# EAGLE design goodfet30 (EAGLE 5.06)
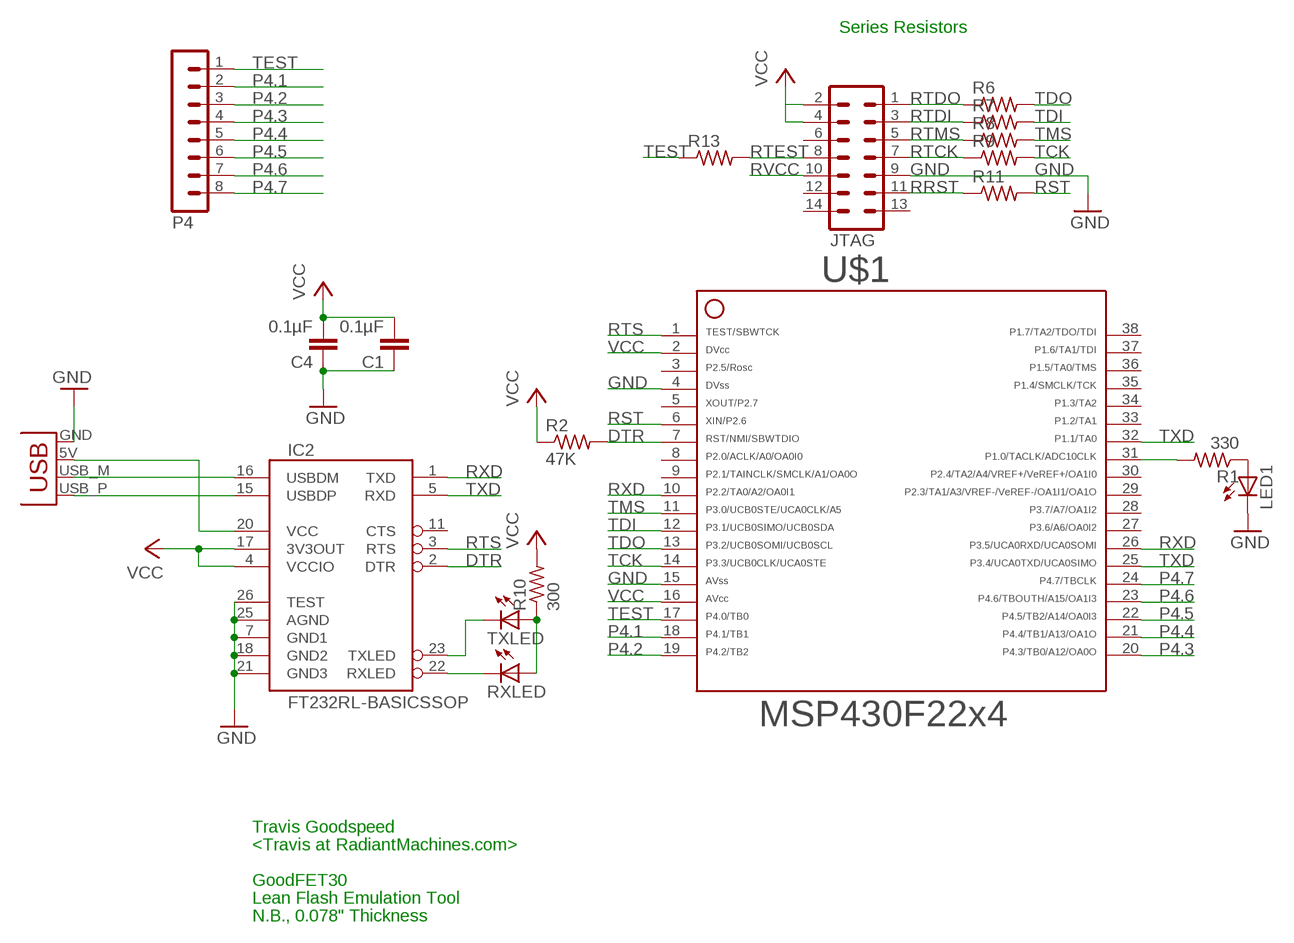
[diagram p0: schematic, sheet 1]

## Parts
C1  0.1µF  C-EUC0603  [C0603]
C4  0.1µF  C-EUC0603  [C0603]
IC2  FT232RL-BASICSSOP  [SSOP28DB]
JTAG  MA07-2  [MA07-2]
LED1  LEDCHIP-LED0603  [CHIP-LED0603]
P4  MA08-1  [MA08-1]
R1  330  R-US_R0603  [R0603]
R2  47K  R-US_R0603  [R0603]
R6  R-US_R0603  [R0603]
R7  R-US_R0603  [R0603]
R8  R-US_R0603  [R0603]
R9  R-US_R0603  [R0603]
R10  300  R-US_R0603  [R0603]
R11  R-US_R0603  [R0603]
R13  R-US_R0603  [R0603]
RXLED  LEDCHIP-LED0603  [CHIP-LED0603]
TXLED  LEDCHIP-LED0603  [CHIP-LED0603]
U$1  F22X4---DA38  [DA38]
X1  USBPCB  [USB-A-PCB]

## Nets
DTR: IC2.2(DTR) R2.2 U$1.7
GND: C1.1 C4.1 IC2.7(GND1) IC2.18(GND2) IC2.21(GND3) IC2.25(AGND) IC2.26(TEST) JTAG.9 LED1.C U$1.4 U$1.15 X1.GND
N$3: IC2.15(USBDP) X1.USB_P(D+)
N$4: IC2.16(USBDM) X1.USB_M(D-)
N$5: IC2.20(VCC) X1.5V(VBUS)
N$6: IC2.22(RXLED) RXLED.C
N$7: IC2.23(TXLED) TXLED.C
N$8: R10.1 RXLED.A TXLED.A
N$9: R1.2 U$1.31
N$10: LED1.A R1.1
P4.1: P4.2 U$1.18
P4.2: P4.3 U$1.19
P4.3: P4.4 U$1.20
P4.4: P4.5 U$1.21
P4.5: P4.6 U$1.22
P4.6: P4.7 U$1.23
P4.7: P4.8 U$1.24
RRST: JTAG.11 R11.1
RST: R11.2 U$1.6
RTCK: JTAG.7 R9.1
RTDI: JTAG.3 R7.1
RTDO: JTAG.1 R6.1
RTEST: JTAG.8 R13.2
RTMS: JTAG.5 R8.1
RTS: IC2.3(RTS) U$1.1
RVCC: JTAG.10
RXD: IC2.1(TXD) U$1.10 U$1.26
TCK: R9.2 U$1.14
TDI: R7.2 U$1.12
TDO: R6.2 U$1.13
TEST: P4.1 R13.1 U$1.17
TMS: R8.2 U$1.11
TXD: IC2.5(RXD) U$1.25 U$1.32
VCC: C1.2 C4.2 IC2.4(VCCIO) IC2.17(3V3OUT) JTAG.2 JTAG.4 R2.1 R10.2 U$1.2 U$1.16
Unconnected: IC2.11(CTS) JTAG.6 JTAG.12 JTAG.13 JTAG.14 U$1.3 U$1.5 U$1.8 U$1.9 U$1.27 U$1.28 U$1.29 U$1.30 U$1.33 U$1.34 U$1.35 U$1.36 U$1.37 U$1.38

## Notes on the sheet
- Series Resistors
- Travis Goodspeed
- <Travis at RadiantMachines.com>
- GoodFET30
- Lean Flash Emulation Tool
- N.B., 0.078" Thickness

## Library data of the parts
C1 C4 = rcl:C-EU: CAPACITOR, European symbol
IC2 = SparkFun:FT232RL-BASIC: USB UART This is the simplified version of the FT232RL unit. Only what you need, nothing you don't. Spark Fun Electronics SKU : COM-00650
JTAG = con-lstb:MA07-2: PIN HEADER
LED1 RXLED TXLED = led:LED: LED OSRAM: - CHIPLED LG R971, LG N971, LY N971, LG Q971, LY Q971, LO R971, LY R971 LH N974, LH R974 LS Q976, LO Q976, LY Q976 LO Q996 - Hyper CHIPLED LW Q18S LB Q993, LB Q99A, LB R99A - SideLED LS A670, LO A670, LY A670, LG A670, LP A670 LB A673, LV A673, LT A673, LW A673 LH A674 LY A675 LS A676, LA A676, LO A676, LY A676, LW A676 LS A679, LY A679, LG A679 - Hyper Micro SIDELED® LS Y876, LA Y876, LO Y876, LY Y876 LT Y87S - SmartLED LW L88C, LW L88S LB L89C, LB L89S, LG L890 LS L89K, LO L89K, LY L89K LS L896, LA L896, LO L896, LY L896 - TOPLED LS T670, LO T670, LY T670, LG T670, LP T670 LSG T670, LSP T670, LSY T670, LOP T670, LYG T670 LG T671, LOG T671, LSG T671 LB T673, LV T673, LT T673, LW T673 LH T674 LS T676, LA T676, LO T676, LY T676, LB T676, LH T676, LSB T676, LW T676 LB T67C, LV T67C, LT T67C, LS T67K, LO T67K, LY T67K, LW E67C LS E67B, LA E67B, LO E67B, LY E67B, LB E67C, LV E67C, LT E67C LW T67C LS T679, LY T679, LG T679 LS T770, LO T770, LY T770, LG T770, LP T770 LB T773, LV T773, LT T773, LW T773 LH T774 LS E675, LA E675, LY E675, LS T675 LS T776, LA T776, LO T776, LY T776, LB T776 LHGB T686 LT T68C, LB T68C - Hyper Mini TOPLED® LB M676 - Mini TOPLED Santana® LG M470 LS M47K, LO M47K, LY M47K Source: http://www.osram.convergy.de LUXEON: - LUMILED® LXK2-PW12-R00, LXK2-PW12-S00, LXK2-PW14-U00, LXK2-PW14-V00 LXK2-PM12-R00, LXK2-PM12-S00, LXK2-PM14-U00 LXK2-PE12-Q00, LXK2-PE12-R00, LXK2-PE12-S00, LXK2-PE14-T00, LXK2-PE14-U00 LXK2-PB12-K00, LXK2-PB12-L00, LXK2-PB12-M00, LXK2-PB14-N00, LXK2-PB14-P00, LXK2-PB14-Q00 LXK2-PR12-L00, LXK2-PR12-M00, LXK2-PR14-Q00, LXK2-PR14-R00 LXK2-PD12-Q00, LXK2-PD12-R00, LXK2-PD12-S00 LXK2-PH12-R00, LXK2-PH12-S00 LXK2-PL12-P00, LXK2-PL12-Q00, LXK2-PL12-R00 Source: www.luxeon.com KINGBRIGHT: KA-3528ASYC Source: www.kingbright.com
P4 = con-lstb:MA08-1: PIN HEADER
R1 R2 R10 = rcl:R-US_: RESISTOR, American symbol
R6-R9 R11 R13 = resistor:R-US_: RESISTOR, American symbol
U$1 = TI_MSP430_v13:F22X4---DA38: ***MSP430F22x4***DA38
X1 = SparkFun:USB: USB Connectors USB-B-PTH is fully proven SKU : PRT-00139 USB-miniB is fully proven SKU : PRT-00587 USB-A-PCB is untested. USB-A-H is throughly reviewed, but untested. Spark Fun Electronics SKU : PRT-00437 USB-B-SMT is throughly reviewed, but untested. Needs silkscreen touching up. USB-A-S has not been used/tested USB-MB-H has not been used/tested

## Board
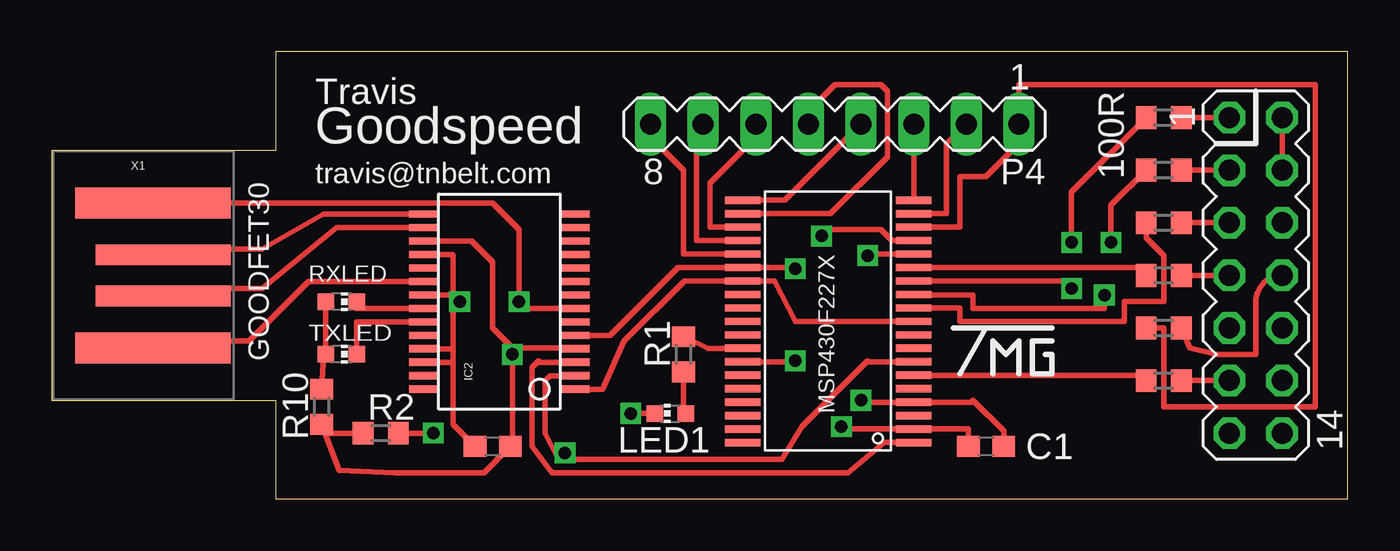
[diagram p1: board, top side]
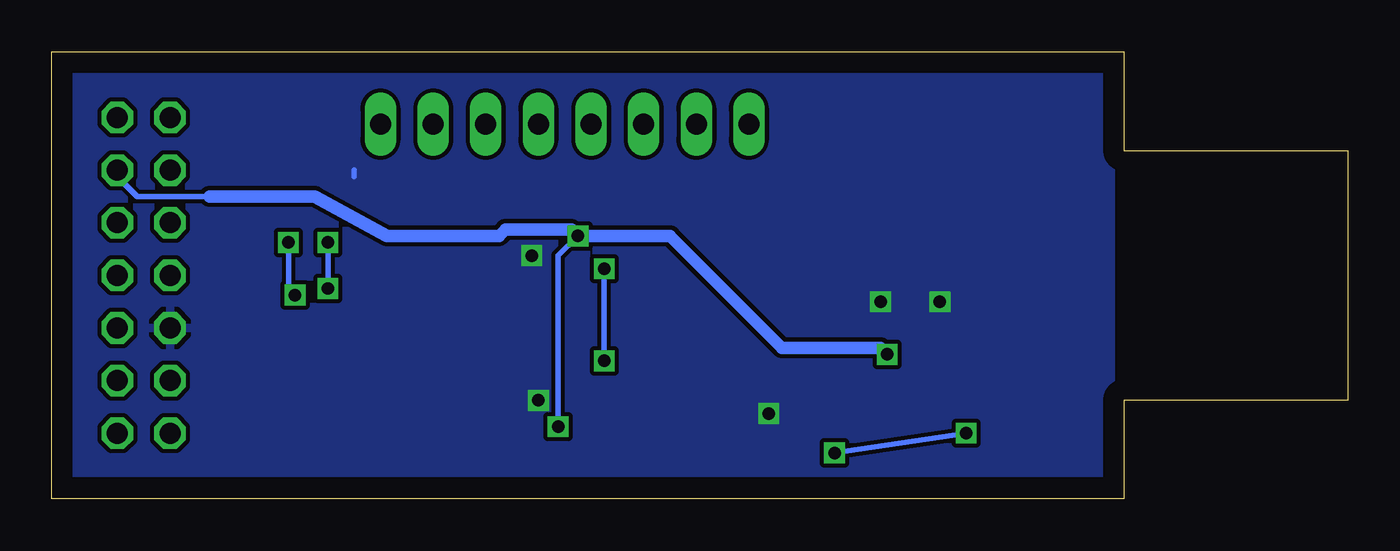
[diagram p2: board, bottom side, seen from below]

Size 62.54 x 21.59 mm. Coordinates in mm from the lower left corner, seen from the top.
Outline: 10.79,0 62.54,0 62.54,21.59 10.79,21.59 10.79,16.83 0,16.83 0,4.76 10.79,4.76 10.79,0
Copper layers (1*16): Top 0.035mm / dielectric 1.5mm / Bottom 0.035mm
Design rules "default *": minimum track width 10mil, minimum drill 10mil, track to track 8mil, track to pad 8mil, pad to pad 8mil, via to via 8mil, smd to smd 8mil, copper to edge 40mil, drill to drill 10mil, minimum pad ring 10mil, minimum via ring 8mil, stop-mask expansion 4mil, vias tented up to drill 0mil, thermal gap 10mil

### Footprints (pad centres in the part's own frame; a part is rotated, then mirrored left to right if it is on the bottom)
C0603 = smd 1.1 x 1: 1 -0.85,0; 2 0.85,0
SSOP28DB = smd 0.348 x 1.397: 1 -4.225,-3.656; 2 -3.575,-3.656; 3 -2.925,-3.656; 4 -2.275,-3.656; 5 -1.625,-3.656; 6 -0.975,-3.656; 7 -0.325,-3.656; 8 0.325,-3.656; 9 0.975,-3.656; 10 1.625,-3.656; 11 2.275,-3.656; 12 2.925,-3.656; 13 3.575,-3.656; 14 4.225,-3.656; 15 4.225,3.656; 16 3.575,3.656; 17 2.925,3.656; 18 2.275,3.656; 19 1.625,3.656; 20 0.975,3.656; 21 0.325,3.656; 22 -0.325,3.656; 23 -0.975,3.656; 24 -1.625,3.656; 25 -2.275,3.656; 26 -2.925,3.656; 27 -3.575,3.656; 28 -4.225,3.656
MA07-2 = drill 1.016 octagon: 1 -7.62,-1.27; 2 -7.62,1.27; 3 -5.08,-1.27; 4 -5.08,1.27; 5 -2.54,-1.27; 6 -2.54,1.27; 7 0,-1.27; 8 0,1.27; 9 2.54,-1.27; 10 2.54,1.27; 11 5.08,-1.27; 12 5.08,1.27; 13 7.62,-1.27; 14 7.62,1.27
CHIP-LED0603 = smd 0.8 x 0.8: A 0,-0.75; C 0,0.75
MA08-1 = drill 1.016 long: 1 -8.89,0; 2 -6.35,0; 3 -3.81,0; 4 -1.27,0; 5 1.27,0; 6 3.81,0; 7 6.35,0; 8 8.89,0
R0603 = smd 1 x 1.1: 1 -0.85,0; 2 0.85,0
DA38 = smd 0.35 x 1.705: 1 -5.85,-4.12; 2 -5.2,-4.12; 3 -4.55,-4.12; 4 -3.9,-4.12; 5 -3.25,-4.12; 6 -2.6,-4.12; 7 -1.95,-4.12; 8 -1.3,-4.12; 9 -0.65,-4.12; 10 0,-4.12; 11 0.65,-4.12; 12 1.3,-4.12; 13 1.95,-4.12; 14 2.6,-4.12; 15 3.25,-4.12; 16 3.9,-4.12; 17 4.55,-4.12; 18 5.2,-4.12; 19 5.85,-4.12; 20 5.85,4.12; 21 5.2,4.12; 22 4.55,4.12; 23 3.9,4.12; 24 3.25,4.12; 25 2.6,4.12; 26 1.95,4.12; 27 1.3,4.12; 28 0.65,4.12; 29 0,4.12; 30 -0.65,4.12; 31 -1.3,4.12; 32 -1.95,4.12; 33 -2.6,4.12; 34 -3.25,4.12; 35 -3.9,4.12; 36 -4.55,4.12; 37 -5.2,4.12; 38 -5.85,4.12
USB-A-PCB = smd 7.5 x 1.5: 5V -0.2,-3.5; GND -0.2,3.5 | smd 6.5 x 1: USB_M 0.3,-1; USB_P 0.3,1

### Placement (x,y rotation side)
C1  45.09,2.54 180 top
C4  21.27,2.54 0 top
IC2  21.59,9.53 90 top
JTAG  58.1,10.79 270 top
LED1  29.85,4.13 90 top
P4  37.78,18.1 180 top
R1  30.48,6.99 90 top
R2  15.88,3.18 0 top
R6  53.66,18.42 180 top
R7  53.66,15.88 180 top
R8  53.66,13.33 180 top
R9  53.66,10.79 180 top
R10  13.02,4.45 270 top
R11  53.66,5.71 180 top
R13  53.66,8.25 0 top
RXLED  13.97,9.53 270 top
TXLED  13.97,6.99 270 top
U$1  37.47,8.57 90 top
X1  5.08,10.79 0 top

### Tracks (layer width: path | path; a pad name or v marks a point on that pad's centre or on a via)
DTR  (via drill 0.6)
  Top 0.254: IC2.2 24.05,5.95 23.81,5.71 23.81,3.18 24.45,1.91 24.76,1.91 | 24.76,1.91 35.24,1.91 36.2,3.49 39.37,6.67 39.41,6.62 U$1.7 | R2.2 v18.41,3.18 | v24.76,2.22 24.76,1.91
  Bottom 0.254: v18.41,3.18 v24.76,2.22
GND  (via drill 0.6)
  Top 0.254: U$1.15 39.45,11.82 v39.37,11.75 | v39.05,4.76 39.05,4.67 U$1.4 44.36,4.67 44.45,4.76 45.94,3.28 C1.1 | IC2.7 22.54,9.2 v22.54,9.53 22.54,13.02 21.27,14.29 X1.GND | IC2.18 19.31,11.8 19.37,11.75 19.37,9.84 | 19.37,6.67 19.37,3.6 C4.1 | 19.37,6.67 19.37,7.3 | 19.37,7.3 19.37,9.84 | IC2.26 19.3,6.6 19.37,6.67 | IC2.25 19.31,7.25 19.37,7.3 | 19.36,9.85 IC2.21 | 19.37,9.84 19.36,9.85 | 19.36,9.85 19.36,9.53 v19.68,9.53 | LED1.C v27.94,4.13
  Bottom 0.254: v39.37,11.75 39.05,11.75 | v39.05,4.76 38.73,4.76 | v22.54,9.53 22.22,9.53 | v19.68,9.53 20,9.53 | 47.94,15.56 47.94,15.88
  pour Bottom: 11.75,20.96 61.6,20.96 61.91,1.27 11.43,1.27 11.43,20.64
N$3
  Top 0.254: IC2.15 13.11,13.75 10.16,12.07 5.65,12.07 X1.USB_P
N$4
  Top 0.254: IC2.16 13.73,13.1 10.16,10.16 5.75,10.16 X1.USB_M
N$5
  Top 0.254: IC2.20 12.4,10.5 9.52,7.62 5.2,7.62 X1.5V
N$6
  Top 0.254: IC2.22 14.72,9.2 RXLED.C
N$7
  Top 0.254: IC2.23 14.72,8.55 TXLED.C
N$8
  Top 0.254: RXLED.A TXLED.A 13.12,6.99 R10.1
N$9
  Top 0.254: U$1.31 31.68,7.27 R1.2
N$10
  Top 0.254: R1.1 30.48,4.33 LED1.A
P4.1
  Top 0.254: U$1.18 43.18,13.77 43.18,17.14 P4.2
P4.2
  Top 0.254: U$1.19 41.59,14.43 P4.3
P4.3
  Top 0.254: U$1.20 35.38,14.42 P4.4
P4.4
  Top 0.254: U$1.21 37.59,13.77 40.32,16.51 40.32,19.68 40.01,20 37.78,20 36.51,18.73 P4.5
P4.5
  Top 0.254: U$1.22 31.75,13.12 31.75,15.24 33.97,17.46 P4.6
P4.6
  Top 0.254: U$1.23 31.11,12.47 31.11,16.83 P4.7
P4.7
  Top 0.254: U$1.24 30.48,11.82 30.48,15.88 28.89,17.46 P4.8
RRST
  Top 0.254: R11.1 JTAG.11
RST
  Top 0.254: U$1.6 52.55,5.97 R11.2
RTCK
  Top 0.254: R9.1 JTAG.7
RTDI
  Top 0.254: R7.1 JTAG.3
RTDO
  Top 0.254: R6.1 JTAG.1
RTEST
  Top 0.254: R13.2 54.93,7.3 56.2,6.99 58.1,6.99 58.1,9.53 arc-90 JTAG.8
RTMS
  Top 0.254: R8.1 JTAG.5
RTS
  Top 0.254: U$1.1 40.19,2.72 38.42,1.27 24.13,1.27 23.18,2.54 23.18,6.35 23.49,6.67 23.56,6.6 IC2.3
RXD
  Top 0.254: IC2.1 26.57,5.3 27.62,7.62 30.53,10.52 U$1.26 34.88,10.52 35.88,8.57 U$1.10
TCK
  Top 0.254: 53.02,10.79 R9.2 52.43,11.17 U$1.14
TDI  (via drill 0.6)
  Top 0.254: R7.2 51.12,14.18 v51.12,12.38 | U$1.12 41.59,9.84 44.45,9.84 44.45,9.21 50.8,9.21 50.8,9.53 v50.8,9.84
  Bottom 0.254: v51.12,12.38 51.12,9.84 v50.8,9.84
TDO  (via drill 0.6)
  Top 0.254: R6.2 49.21,14.82 v49.21,12.38 | v49.21,10.16 48.85,10.52 U$1.13
  Bottom 0.254: v49.21,10.16 v49.21,12.38
TEST
  Top 0.254: U$1.17 43.82,13.12 43.82,15.56 45.09,15.56 46.67,17.14 P4.1 46.67,20 60.96,20 60.96,4.45 53.66,4.45 53.66,8.25 R13.1
TMS
  Top 0.254: R8.2 52.81,12.6 53.66,11.75 53.66,9.53 53.34,9.53 53.33,9.54 51.75,9.53 51.75,8.57 43.82,8.57 43.82,9.22 U$1.11
TXD  (via drill 0.6)
  Top 0.254: IC2.5 26.95,7.9 30.22,11.17 U$1.25 35.56,11.17 v35.88,11.11 | U$1.32 35.56,6.62 v35.88,6.67
  Bottom 0.254: v35.88,11.11 v35.88,6.67
VCC  (via drill 0.6)
  Top 0.254: JTAG.4 JTAG.2 | IC2.4 25.19,7.3 22.22,7.3 | IC2.17 20.25,12.45 21.27,11.43 21.27,8.25 22.22,7.3 | R2.1 13.44,3.18 R10.2 13.87,1.37 16.51,1.27 20.85,1.27 C4.2 22.22,2.64 v22.22,6.99 22.22,7.3 | U$1.16 40.55,12.47 40.01,13.02 37.47,13.02 v37.15,12.7 | v38.1,3.49 38.22,3.37 U$1.2 44.23,3.37 C1.2
  Bottom 0.254: JTAG.4 59.37,15.56 58.42,14.61 54.93,14.61 | v38.1,3.49 38.1,11.75 v37.15,12.7
  Bottom 0.61: v22.22,6.99 22.54,7.3 27.3,7.3 32.7,12.7 v37.15,12.7 37.47,13.02 40.64,13.02 40.96,12.7 46.36,12.7 49.85,14.61 54.93,14.61

### Text on the board
tPlace: Travis | 100R | Goodspeed | travis@tnbelt.com | GOODFET30
tNames: MSP430F227X